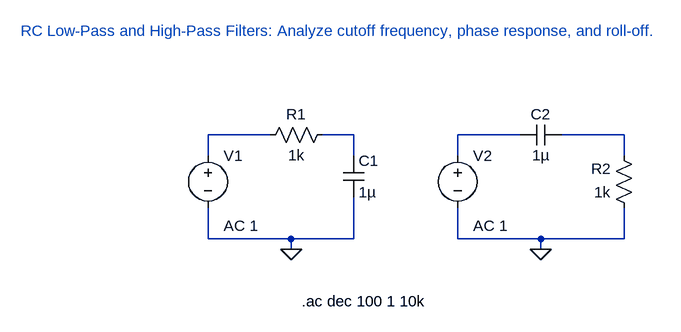
[diagram p0: schematic RC lowpass and highpass.asc]
RC lowpass and highpass.asc, the LTspice schematic file:
Version 4
SHEET 1 1056 680
WIRE 384 256 288 256
WIRE 512 256 464 256
WIRE 768 256 672 256
WIRE 928 256 832 256
WIRE 288 288 288 256
WIRE 512 288 512 256
WIRE 672 288 672 256
WIRE 928 288 928 256
WIRE 288 416 288 368
WIRE 416 416 288 416
WIRE 512 416 512 352
WIRE 512 416 416 416
WIRE 672 416 672 368
WIRE 800 416 672 416
WIRE 928 416 928 368
WIRE 928 416 800 416
WIRE 416 432 416 416
WIRE 800 432 800 416
FLAG 416 432 0
FLAG 800 432 0
SYMBOL voltage 288 272 R0
WINDOW 123 24 124 Left 2
WINDOW 39 0 0 Left 0
SYMATTR InstName V1
SYMATTR Value ""
SYMATTR Value2 AC 1
SYMBOL voltage 672 272 R0
WINDOW 123 24 124 Left 2
WINDOW 39 0 0 Left 0
SYMATTR InstName V2
SYMATTR Value ""
SYMATTR Value2 AC 1
SYMBOL res 480 240 R90
WINDOW 0 0 56 VBottom 2
WINDOW 3 32 56 VTop 2
SYMATTR InstName R1
SYMATTR Value 1k
SYMBOL res 944 384 R180
WINDOW 0 36 76 Left 2
WINDOW 3 36 40 Left 2
SYMATTR InstName R2
SYMATTR Value 1k
SYMBOL cap 496 288 R0
SYMATTR InstName C1
SYMATTR Value 1µ
SYMBOL cap 832 240 R90
WINDOW 0 0 32 VBottom 2
WINDOW 3 32 32 VTop 2
SYMATTR InstName C2
SYMATTR Value 1µ
TEXT 0 96 Left 2 ;RC Low-Pass and High-Pass Filters: Analyze cutoff frequency, phase response, and roll-off.
TEXT 432 512 Left 2 !.ac dec 100 1 10k

The netlist it stands for:
* RC lowpass and highpass.asc
V1 N001 0 AC 1
V2 N003 0 AC 1
R1 N002 N001 1k
R2 0 N004 1k
C1 N002 0 1µ
C2 N004 N003 1µ
* RC Low-Pass and High-Pass Filters: Analyze cutoff frequency, phase response, and roll-off.
.ac dec 100 1 10k
.backanno
.end